# Altium schematic sheet PERIPHERAL.SchDoc: PERIPHERAL
size A3; Author: DODANHLUONG; Revision: 1.0; SheetNumber: 5; SheetTotal: 5; ProjectTitle: DSP_VERSION_1.0
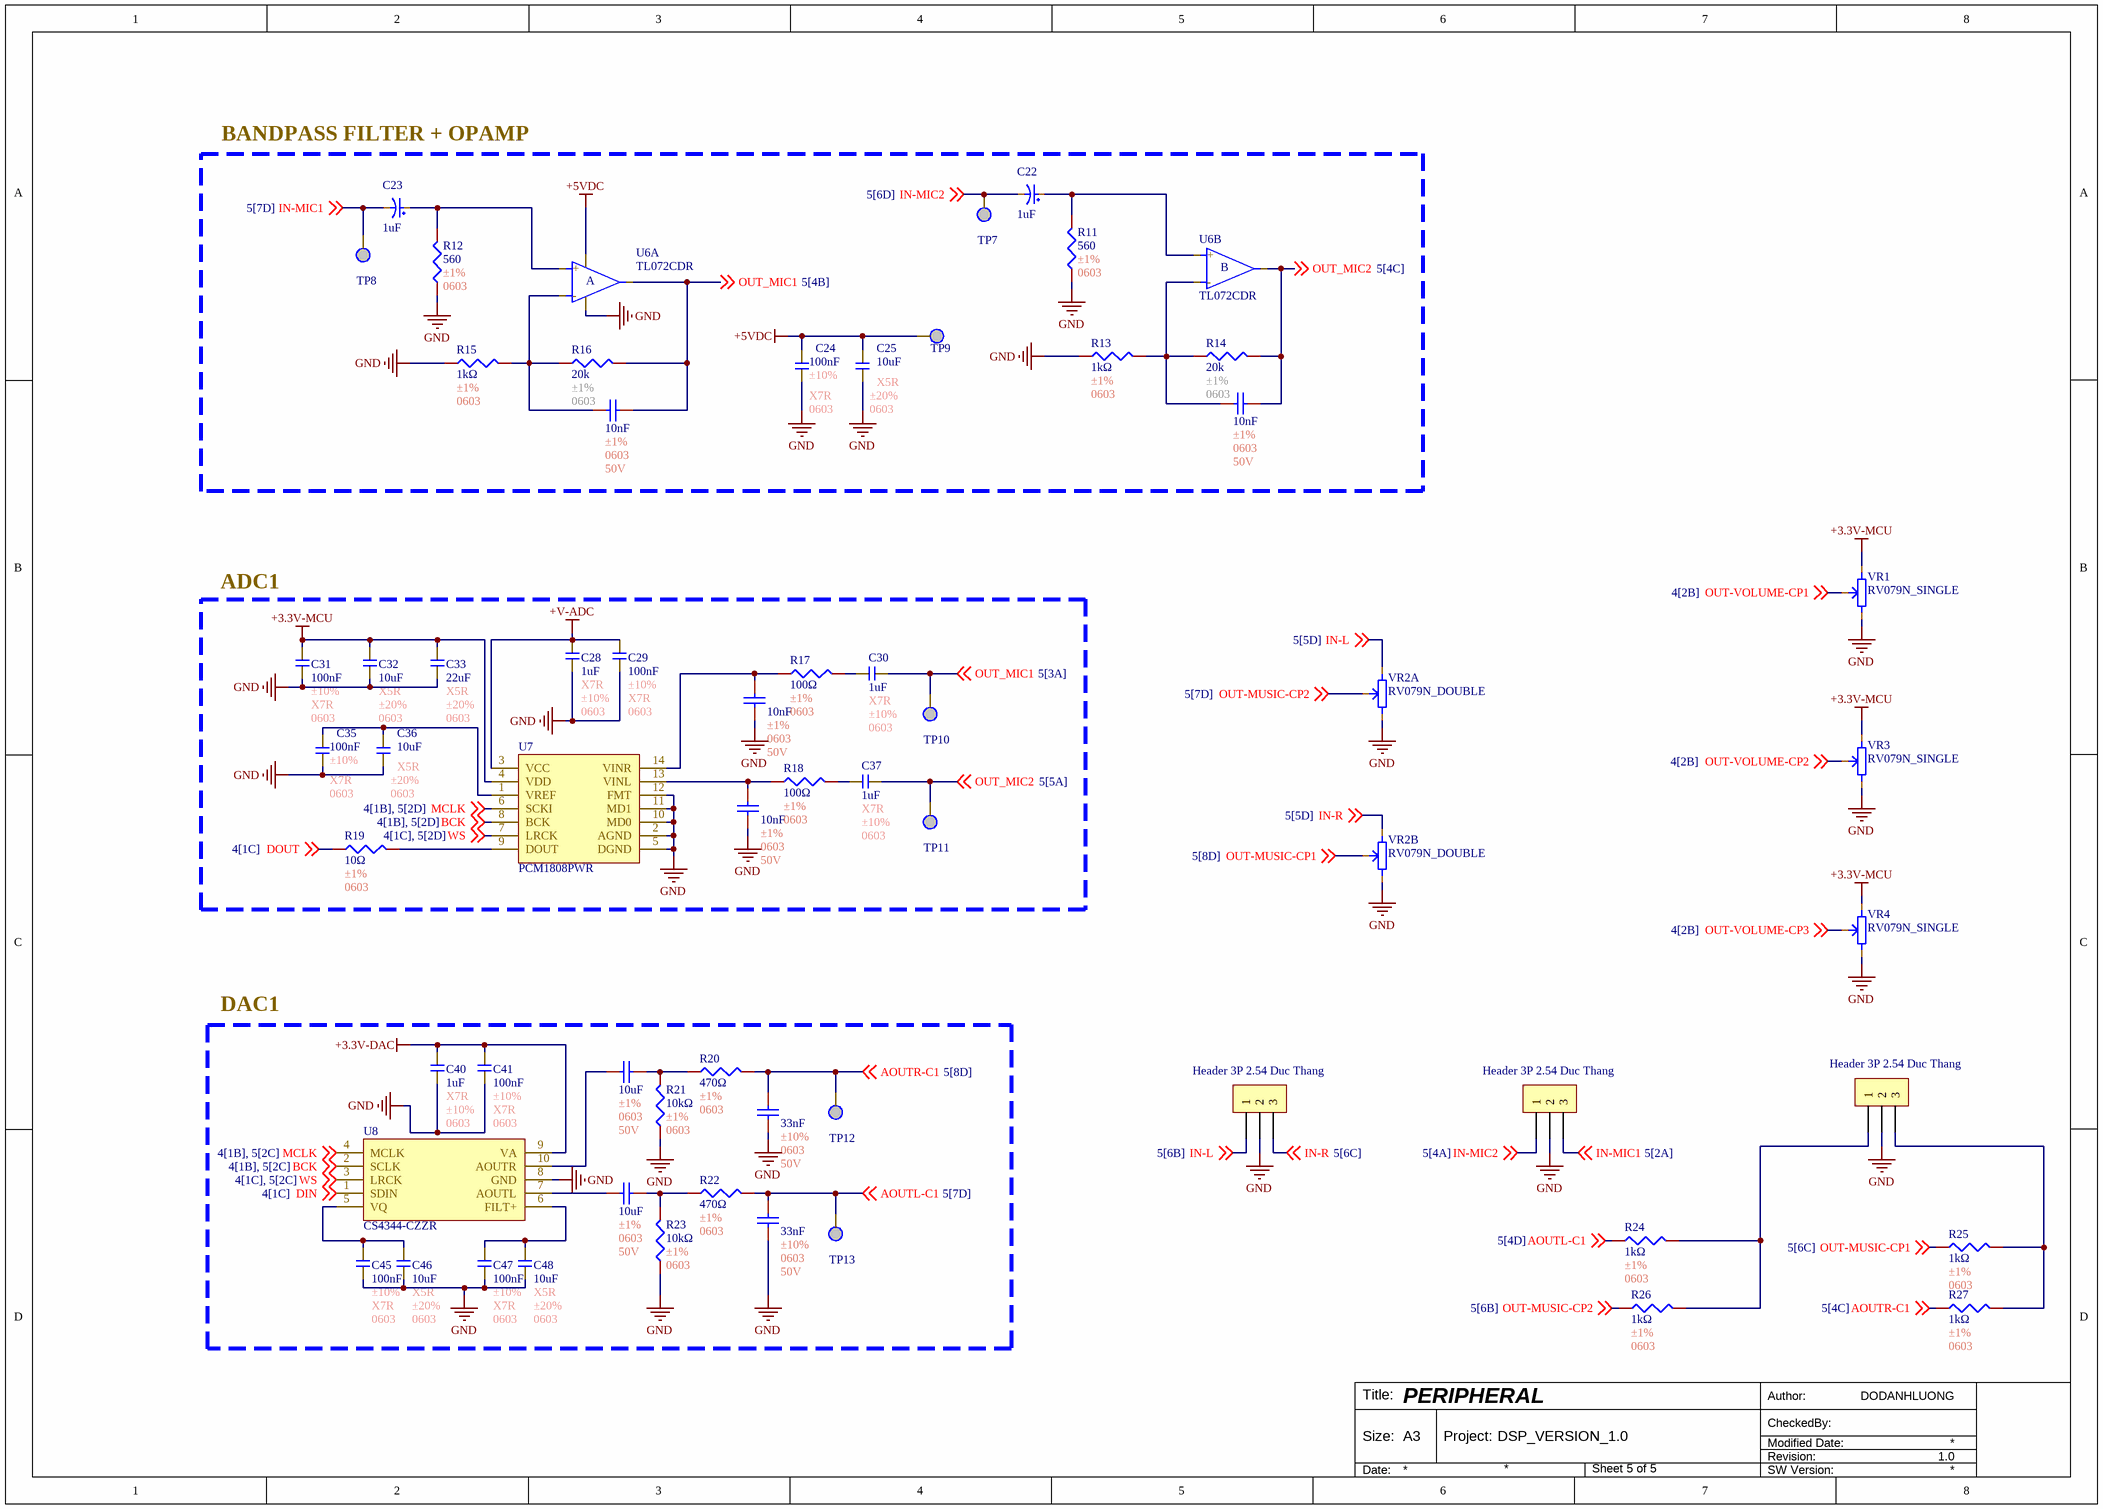
[diagram p0: PERIPHERAL.SchDoc]

## Parts
C22  1uF  [C_TH_5x11mm]
C23  1uF  [C_TH_5x11mm]
C24  100nF  Tolerance: ±10%  Temperature Coefficient: X7R  Package: 0603  [C0603]
C25  10uF  Temperature Coefficient: X5R  Tolerance: ±20%  Package: 0603  [C0603]
C26  10nF  Tolerance: ±1%  Package: 0603  Voltage Rating: 50V  [C0603]
C27  10nF  Tolerance: ±1%  Package: 0603  Voltage Rating: 50V  [C0603]
C28  1uF  Temperature Coefficient: X7R  Tolerance: ±10%  Package: 0603  [C0603]
C29  100nF  Tolerance: ±10%  Temperature Coefficient: X7R  Package: 0603  [C0603]
C30  1uF  Temperature Coefficient: X7R  Tolerance: ±10%  Package: 0603  [C0603]
C31  100nF  Tolerance: ±10%  Temperature Coefficient: X7R  Package: 0603  [C0603]
C32  10uF  Temperature Coefficient: X5R  Tolerance: ±20%  Package: 0603  [C0603]
C33  22uF  Temperature Coefficient: X5R  Tolerance: ±20%  Package: 0603  [C0603]
C34  10nF  Tolerance: ±1%  Package: 0603  Voltage Rating: 50V  [C0603]
C35  100nF  Tolerance: ±10%  Temperature Coefficient: X7R  Package: 0603  [C0603]
C36  10uF  Temperature Coefficient: X5R  Tolerance: ±20%  Package: 0603  [C0603]
C37  1uF  Temperature Coefficient: X7R  Tolerance: ±10%  Package: 0603  [C0603]
C38  10nF  Tolerance: ±1%  Package: 0603  Voltage Rating: 50V  [C0603]
C39  10uF  Tolerance: ±1%  Package: 0603  Voltage Rating: 50V  [C0603]
C40  1uF  Temperature Coefficient: X7R  Tolerance: ±10%  Package: 0603  [C0603]
C41  100nF  Tolerance: ±10%  Temperature Coefficient: X7R  Package: 0603  [C0603]
C42  33nF  Tolerance: ±10%  Package: 0603  Voltage Rating: 50V  [C0603]
C43  10uF  Tolerance: ±1%  Package: 0603  Voltage Rating: 50V  [C0603]
C44  33nF  Tolerance: ±10%  Package: 0603  Voltage Rating: 50V  [C0603]
C45  100nF  Tolerance: ±10%  Temperature Coefficient: X7R  Package: 0603  [C0603]
C46  10uF  Temperature Coefficient: X5R  Tolerance: ±20%  Package: 0603  [C0603]
C47  100nF  Tolerance: ±10%  Temperature Coefficient: X7R  Package: 0603  [C0603]
C48  10uF  Temperature Coefficient: X5R  Tolerance: ±20%  Package: 0603  [C0603]
H1  Header 3P 2.54 Duc Thang  [XH2.54M-3]
H2  Header 3P 2.54 Duc Thang  [XH2.54M-3]
H3  Header 3P 2.54 Duc Thang  [XH2.54M-3]
R11  560  Tolerance: ±1%  Package: 0603  [R0603]
R12  560  Tolerance: ±1%  Package: 0603  [R0603]
R13  1kΩ  Tolerance: ±1%  Package: 0603  [R0603]
R14  20k  Tolerance: ±1%  Package: 0603  [R0603]
R15  1kΩ  Tolerance: ±1%  Package: 0603  [R0603]
R16  20k  Tolerance: ±1%  Package: 0603  [R0603]
R17  100Ω  Tolerance: ±1%  Package: 0603  [R0603]
R18  100Ω  Tolerance: ±1%  Package: 0603  [R0603]
R19  10Ω  Tolerance: ±1%  Package: 0603  [R0603]
R20  470Ω  Tolerance: ±1%  Package: 0603  [R0603]
R21  10kΩ  Tolerance: ±1%  Package: 0603  [R0603]
R22  470Ω  Tolerance: ±1%  Package: 0603  [R0603]
R23  10kΩ  Tolerance: ±1%  Package: 0603  [R0603]
R24  1kΩ  Tolerance: ±1%  Package: 0603  [R0603]
R25  1kΩ  Tolerance: ±1%  Package: 0603  [R0603]
R26  1kΩ  Tolerance: ±1%  Package: 0603  [R0603]
R27  1kΩ  Tolerance: ±1%  Package: 0603  [R0603]
TP7  TP  [TP]  (value not drawn)
TP8  TP  [TP]  (value not drawn)
TP9  TP  [TP]  (value not drawn)
TP10  TP  [TP]  (value not drawn)
TP11  TP  [TP]  (value not drawn)
TP12  TP  [TP]  (value not drawn)
TP13  TP  [TP]  (value not drawn)
U6  TL072CDR  [TL072CDR]  (parts A,B of 2)
U7  PCM1808PWR  [PCM1808PWR]
U8  CS4344-CZZR  [CS4344-CZZR]
VR1  RV079N_SINGLE  [RK079N_SINGLE]
VR2  RV079N_DOUBLE  [RK079N_DOUBLE]  (parts A,B of 2)
VR3  RV079N_SINGLE  [RK079N_SINGLE]
VR4  RV079N_SINGLE  [RK079N_SINGLE]

## Blocks framed on the sheet
BANDPASS FILTER + OPAMP: C22-C27 R11-R16 TP7-TP9 U6
ADC1: C28-C38 R17-R19 TP10 TP11 U7
DAC1: C39-C48 R20-R23 TP12 TP13 U8

## Nets
+3.3V-DAC: C40.2 C41.2 U8.9(VA)
+3.3V-MCU: C31.2 C32.2 C33.2 U7.4(VDD) VR1.3 VR3.3 VR4.3
+5VDC: C24.2 C25.2 TP9.1 U6.8
+V-ADC: C28.2 C29.2 U7.3(VCC)
GND: C24.1 C25.1 C28.1 C29.1 C31.1 C32.1 C33.1 C34.2 C35.1 C36.1 C38.2 C40.1 C41.1 C42.2 C44.2 C45.1 C46.1 C47.1 C48.1 H1.2 H2.2 H3.2 R11.1 R12.1 R13.1 R15.1 R21.1 R23.1 U6.4(GND) U7.2(AGND) U7.5(DGND) U7.10(MD0) U7.11(MD1) U7.12(FMT) U8.8(GND) VR1.1 VR2.1 VR2.4 VR3.1 VR4.1
AOUTL-C1: C44.1 R22.2 R24.1 TP13.1 ; off-sheet AOUTL-C1
AOUTR-C1: C42.1 R20.2 R27.1 TP12.1 ; off-sheet AOUTR-C1
BCK: U7.8(BCK) U8.2(SCLK) ; off-sheet BCK
DIN: U8.1(SDIN) ; off-sheet DIN
DOUT: R19.1 ; off-sheet DOUT
IN-L: H2.1 VR2.3 ; off-sheet IN-L
IN-MIC1: C23.2 H3.3 TP8.1 ; off-sheet IN-MIC1
IN-MIC2: C22.2 H3.1 TP7.1 ; off-sheet IN-MIC2
IN-R: H2.3 VR2.6 ; off-sheet IN-R
MCLK: U7.6(SCKI) U8.4(MCLK) ; off-sheet MCLK
OUT-MUSIC-CP1: R25.1 VR2.5 ; off-sheet OUT-MUSIC-CP1
OUT-MUSIC-CP2: R26.1 VR2.2 ; off-sheet OUT-MUSIC-CP2
OUT-VOLUME-CP1: VR1.2 ; off-sheet OUT-VOLUME-CP1
OUT-VOLUME-CP2: VR3.2 ; off-sheet OUT-VOLUME-CP2
OUT-VOLUME-CP3: VR4.2 ; off-sheet OUT-VOLUME-CP3
OUT_MIC1: C27.2 C30.1 R16.2 TP10.1 U6.1(out) ; off-sheet OUT_MIC1
OUT_MIC2: C26.2 C37.1 R14.2 TP11.1 U6.7(out) ; off-sheet OUT_MIC2
WS: U7.7(LRCK) U8.3(LRCK) ; off-sheet WS
NetC22_1: C22.1 R11.2 U6.5(+)
NetC23_1: C23.1 R12.2 U6.3(+)
NetC26_1: C26.1 R13.2 R14.1 U6.6(-)
NetC27_1: C27.1 R15.2 R16.1 U6.2(-)
NetC30_2: C30.2 R17.2
NetC34_1: C34.1 R17.1 U7.14(VINR)
NetC35_2: C35.2 C36.2 U7.1(VREF)
NetC37_2: C37.2 R18.2
NetC38_1: C38.1 R18.1 U7.13(VINL)
NetC39_1: C39.1 R20.1 R21.2
NetC39_2: C39.2 U8.10(AOUTR)
NetC43_1: C43.1 R22.1 R23.2
NetC43_2: C43.2 U8.7(AOUTL)
NetC45_2: C45.2 C46.2 U8.5(VQ)
NetC47_2: C47.2 C48.2 U8.6(FILT+)
NetH1_1: H1.1 R24.2 R26.2
NetH1_3: H1.3 R25.2 R27.2
NetR19_2: R19.2 U7.9(DOUT)

## Notes on the sheet
- Author:
- Title:
- Size:
- A3
- Project:
- Revision:
- Modified Date:
- CheckedBy:
- Date:
- SW Version:
- (in symbol TL072CDR, part A) A
- (in symbol TL072CDR, part B) B

## Library data of the parts
C22 C23 = C_10uF_5x11TH: 10uF 50V ±20% Through Hole,D5xL11mm Aluminum Electrolytic Capacitors - Leaded ROHS; Manufacturer: Rubycon; Mfr. Part #: 50YXF10MEFC5X11; Key Attributes: CAP ALUM 10uF ±20% 50V TH; Pin Spacing: 2mm; LCSC Part #: C88726; Package: Through Hole,D5xL11mm; Tolerance: ±20%; Voltage Rating: 50V; Capacitance: 10uF; Link: https://www.lcsc.com/product-detail/C88726.html?s_z=n_electrolytic%252010uF
C24 C29 C31 C35 C41 C45 C47 = C0603_100nF_±10%_X7R: 50V 100nF X7R ±10% 0603 Multilayer Ceramic Capacitors MLCC - SMD/SMT ROHS; Manufacturer: YAGEO; Mfr. Part #: CC0603KRX7R9BB104; LCSC Part #: C14663; Capacitance: 100nF; Link: https://www.lcsc.com/product-detail/C14663.html?s_z=n_capital%25200603%2520100nf
C25 C32 C36 C46 C48 = C0603_10uF_±10%_X7R: 25V 10uF X5R ±20% 0603 Multilayer Ceramic Capacitors MLCC - SMD/SMT ROHS; Manufacturer: YAGEO; Mfr. Part #: CC0603MRX5R8BB106; LCSC Part #: C596327; Capacitance: 10uF; Link: https://www.lcsc.com/product-detail/C596327.html?s_z=n_capital%25200603%252010uF%2520yageo
C26 C27 C34 C38 = C0603_10nF_±1%: 50V 10pF NP0 ±1% 0402 Multilayer Ceramic Capacitors MLCC - SMD/SMT ROHS; Manufacturer: YAGEO; Mfr. Part #: CC0402FRNPO9BN100; LCSC Part #: C513681; Link: https://www.lcsc.com/product-detail/C513681.html?s_z=n_capital%2520yageo%252010pF%25200402; Capacitance: 10nF
C28 C30 C37 C40 = C0603_1uF_±10%_X7R: 50V 1uF X7R ±10% 0603 Multilayer Ceramic Capacitors MLCC - SMD/SMT ROHS; Manufacturer: YAGEO; Mfr. Part #: CC0603KRX7R9BB105; LCSC Part #: C559769; Capacitance: 1uF; Link: https://www.lcsc.com/product-detail/C559769.html?s_z=n_capital%25200603%25201uF%2520yageo
C33 = C0603_22uF_±20%_X5R: 6.3V 22uF X5R ±20% 0603 Multilayer Ceramic Capacitors MLCC - SMD/SMT ROHS; Manufacturer: YAGEO; Mfr. Part #: CC0603MRX5R5BB226; LCSC Part #: C109448; ComponentLink1Description: New link; ComponentLink1URL: *; Capacitance: 22uF; Link: https://www.lcsc.com/product-detail/C109448.html?s_z=n_capital%25200603%252022uf%2520yageo
C39 C43 = C0603_10uF_±1%: 50V 10pF NP0 ±1% 0402 Multilayer Ceramic Capacitors MLCC - SMD/SMT ROHS; Manufacturer: YAGEO; Mfr. Part #: CC0402FRNPO9BN100; LCSC Part #: C513681; Link: https://www.lcsc.com/product-detail/C513681.html?s_z=n_capital%2520yageo%252010pF%25200402; Capacitance: 10uF
C42 C44 = C0603_33nF_±10%: 100mW Thick Film Resistor 75V ±100ppm/℃ ±1% 470Ω 0603 Chip Resistor - Surface Mount ROHS; Manufacturer: YAGEO; Mfr. Part #: CC0603KRX7R9BB333; Temperature Coefficient: X7R; LCSC Part #: C106856; Link: https://www.lcsc.com/product-detail/C106856.html?s_z=n_capital%2520yageo%25200603%252033nF; Capacitance: 33nF
H1-H3 = Header 3P 2.54 Duc Thang: Cắm; Ten_Linh_Kien: Header 3P XH2.54-3P Đực Thẳng; Don_Vi: Con; Ma_Hang: MH001292; Chung_Loai: Cắm
R11 R12 = R0603_10kΩ_±1%: 62.5mW Thick Film Resistor 50V ±1% ±200ppm/℃ 10Ω 0402 Chip Resistor - Surface Mount ROHS; Manufacturer: YAGEO; Mfr. Part #: RC0402FR-0710RL; Resistance: 10kΩ; LCSC Part #: C138066; Link: https://www.lcsc.com/product-detail/C138066.html?s_z=n_resistor%25200402%252010R
R13 R15 R24-R27 = R0603_1kΩ_±1%: 62.5mW Thick Film Resistor 50V ±1% ±200ppm/℃ 10Ω 0402 Chip Resistor - Surface Mount ROHS; Manufacturer: YAGEO; Mfr. Part #: RC0402FR-0710RL; LCSC Part #: C138066; Resistance: 1kΩ; Link: https://www.lcsc.com/product-detail/C138066.html?s_z=n_resistor%25200402%252010R
R14 R16 = R0603_5k1Ω_±1%: 100mW Thick Film Resistor 75V ±100ppm/℃ ±1% 5.1kΩ 0603 Chip Resistor - Surface Mount ROHS; Manufacturer: FOJAN; Mfr. Part #: FRC0603F5101TS; Key Attributes: RES 5.1kΩ ±1% 100mW 0603; Resistance: 5k1Ω; LCSC Part #: C2907044; Link: https://www.lcsc.com/product-detail/C2907044.html?s_z=n_5k1%25200603
R17 R18 = R0603_100Ω_±1%: 62.5mW Thick Film Resistor 50V ±1% ±200ppm/℃ 10Ω 0402 Chip Resistor - Surface Mount ROHS; Manufacturer: YAGEO; Mfr. Part #: RC0402FR-0710RL; LCSC Part #: C138066; Resistance: 100Ω; Link: https://www.lcsc.com/product-detail/C138066.html?s_z=n_resistor%25200402%252010R
R19 = R0603_10Ω_±1%: 62.5mW Thick Film Resistor 50V ±1% ±200ppm/℃ 10Ω 0402 Chip Resistor - Surface Mount ROHS; Manufacturer: YAGEO; Mfr. Part #: RC0402FR-0710RL; LCSC Part #: C138066; Resistance: 10Ω; Link: https://www.lcsc.com/product-detail/C138066.html?s_z=n_resistor%25200402%252010R
R20 R22 = R0603_470Ω_±1%_1: 62.5mW Thick Film Resistor 50V ±1% ±200ppm/℃ 10Ω 0402 Chip Resistor - Surface Mount ROHS; Manufacturer: YAGEO; Mfr. Part #: RC0603FR-07470RL; Key Attributes: RES 470Ω ±1% 100mW 0603; LCSC Part #: C114669; Resistance: 470Ω; Link: https://www.lcsc.com/product-detail/C114669.html?s_z=n_resistor%2520470%25CE%25A9%25200603%2520yageo
R21 R23 = R0603_10kΩ_±1%: 62.5mW Thick Film Resistor 50V ±1% ±200ppm/℃ 10Ω 0402 Chip Resistor - Surface Mount ROHS; Manufacturer: YAGEO; Mfr. Part #: RC0402FR-0710RL; LCSC Part #: C138066; Resistance: 10kΩ; Link: https://www.lcsc.com/product-detail/C138066.html?s_z=n_resistor%25200402%252010R
U6 = TL072CDR: 3mV 65pA 3MHz 13V/us 2 SOIC-8 FET Input Amplifiers ROHS; Manufacturer: TI; Noise density(eN): 18nV/√Hz@1kHz; Dual Supply: -15V~15V; Number of Channels: 2; LCSC Part #: C67473; Package: SOIC-8; Gain Bandwidth Product: 3MHz; Link: https://www.lcsc.com/product-detail/C67473.html?s_z=n_TL072CDR; Mfr. Part #: TL072CDR
U7 = PCM1808PWR: 4.5V~5.5V 24 I2S TSSOP-14 ADCs/DACs - Special Purpose ROHS; Manufacturer: TI; Key Attributes: Single-ended analog input 24-bit 96kHz stereo A/D converter; Number of Channels: 2; Mfr. Part #: PCM1808PWR; LCSC Part #: C55513; Package: TSSOP-14; Voltage - Supply: 4.5V~5.5V; Interface: I2S; Link: https://www.lcsc.com/product-detail/C55513.html?s_z=n_pcm1808
U8 = CS4344-CZZR: 250ms I2S 3.3V~5V 24 TSSOP-10-3mm Digital to Analog Converters (DAC) ROHS; Manufacturer: Cirrus Logic; Key Attributes: 10-Pin, 24-Bit, 192 kHz Stereo D/A Converter; Number of Channels: 2; Mfr. Part #: CS4344-CZZR; LCSC Part #: C8952; Package: TSSOP-10-3mm; Link: https://www.lcsc.com/product-detail/C8952.html?s_z=n_cs4344; Voltage - Supply: 3.3V~5V; Interface: I2S